# EAGLE design v3 (EAGLE 9.6.0)
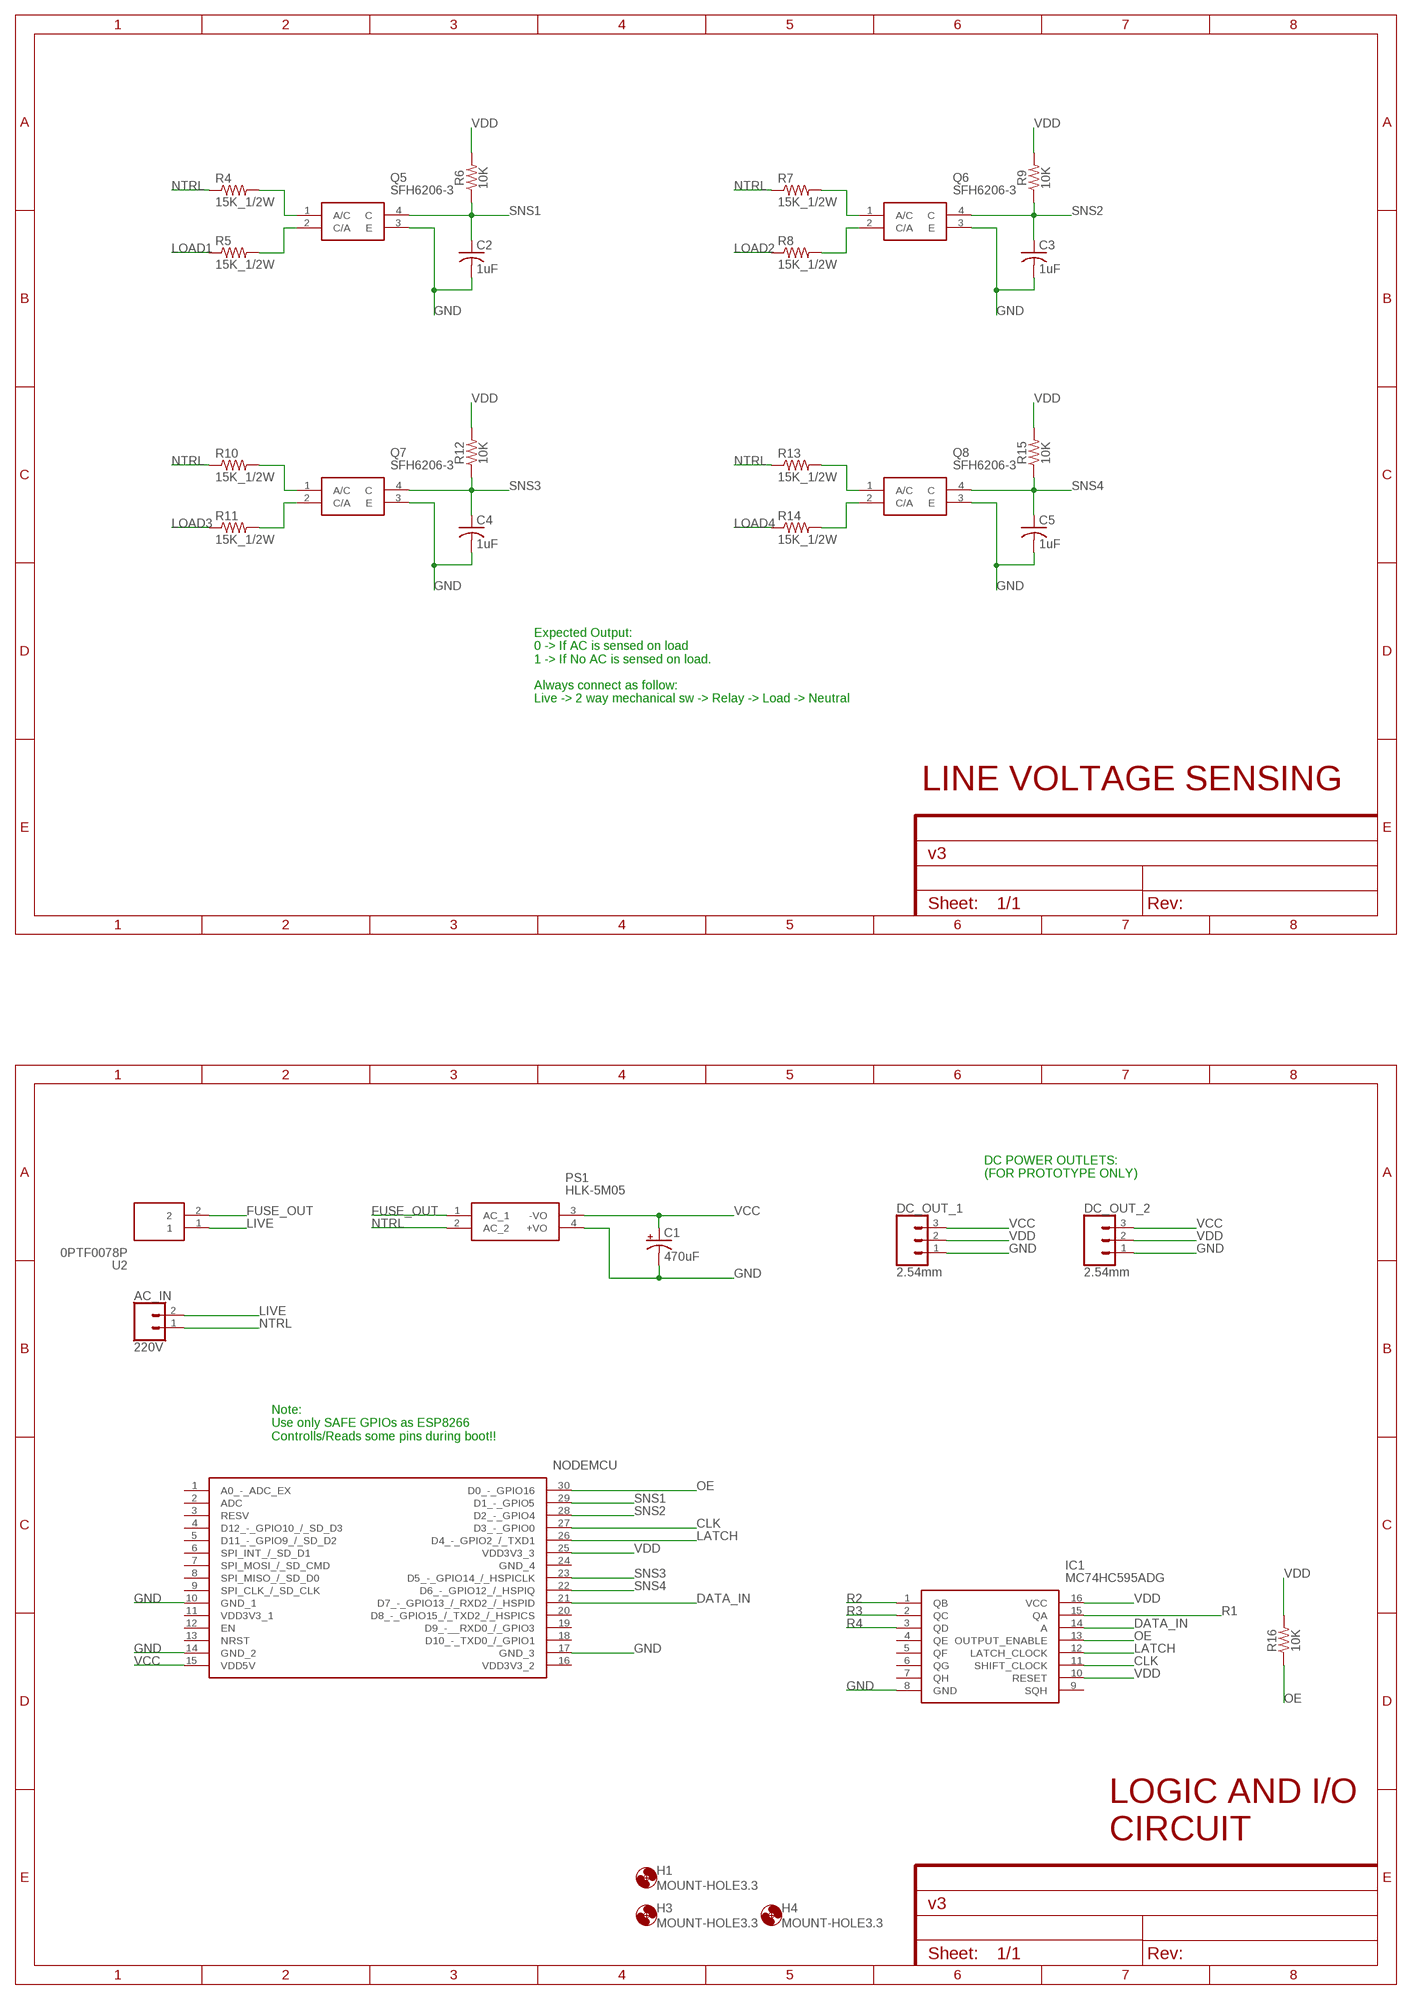
[diagram p0: schematic, sheet 1, part 1 of 2]
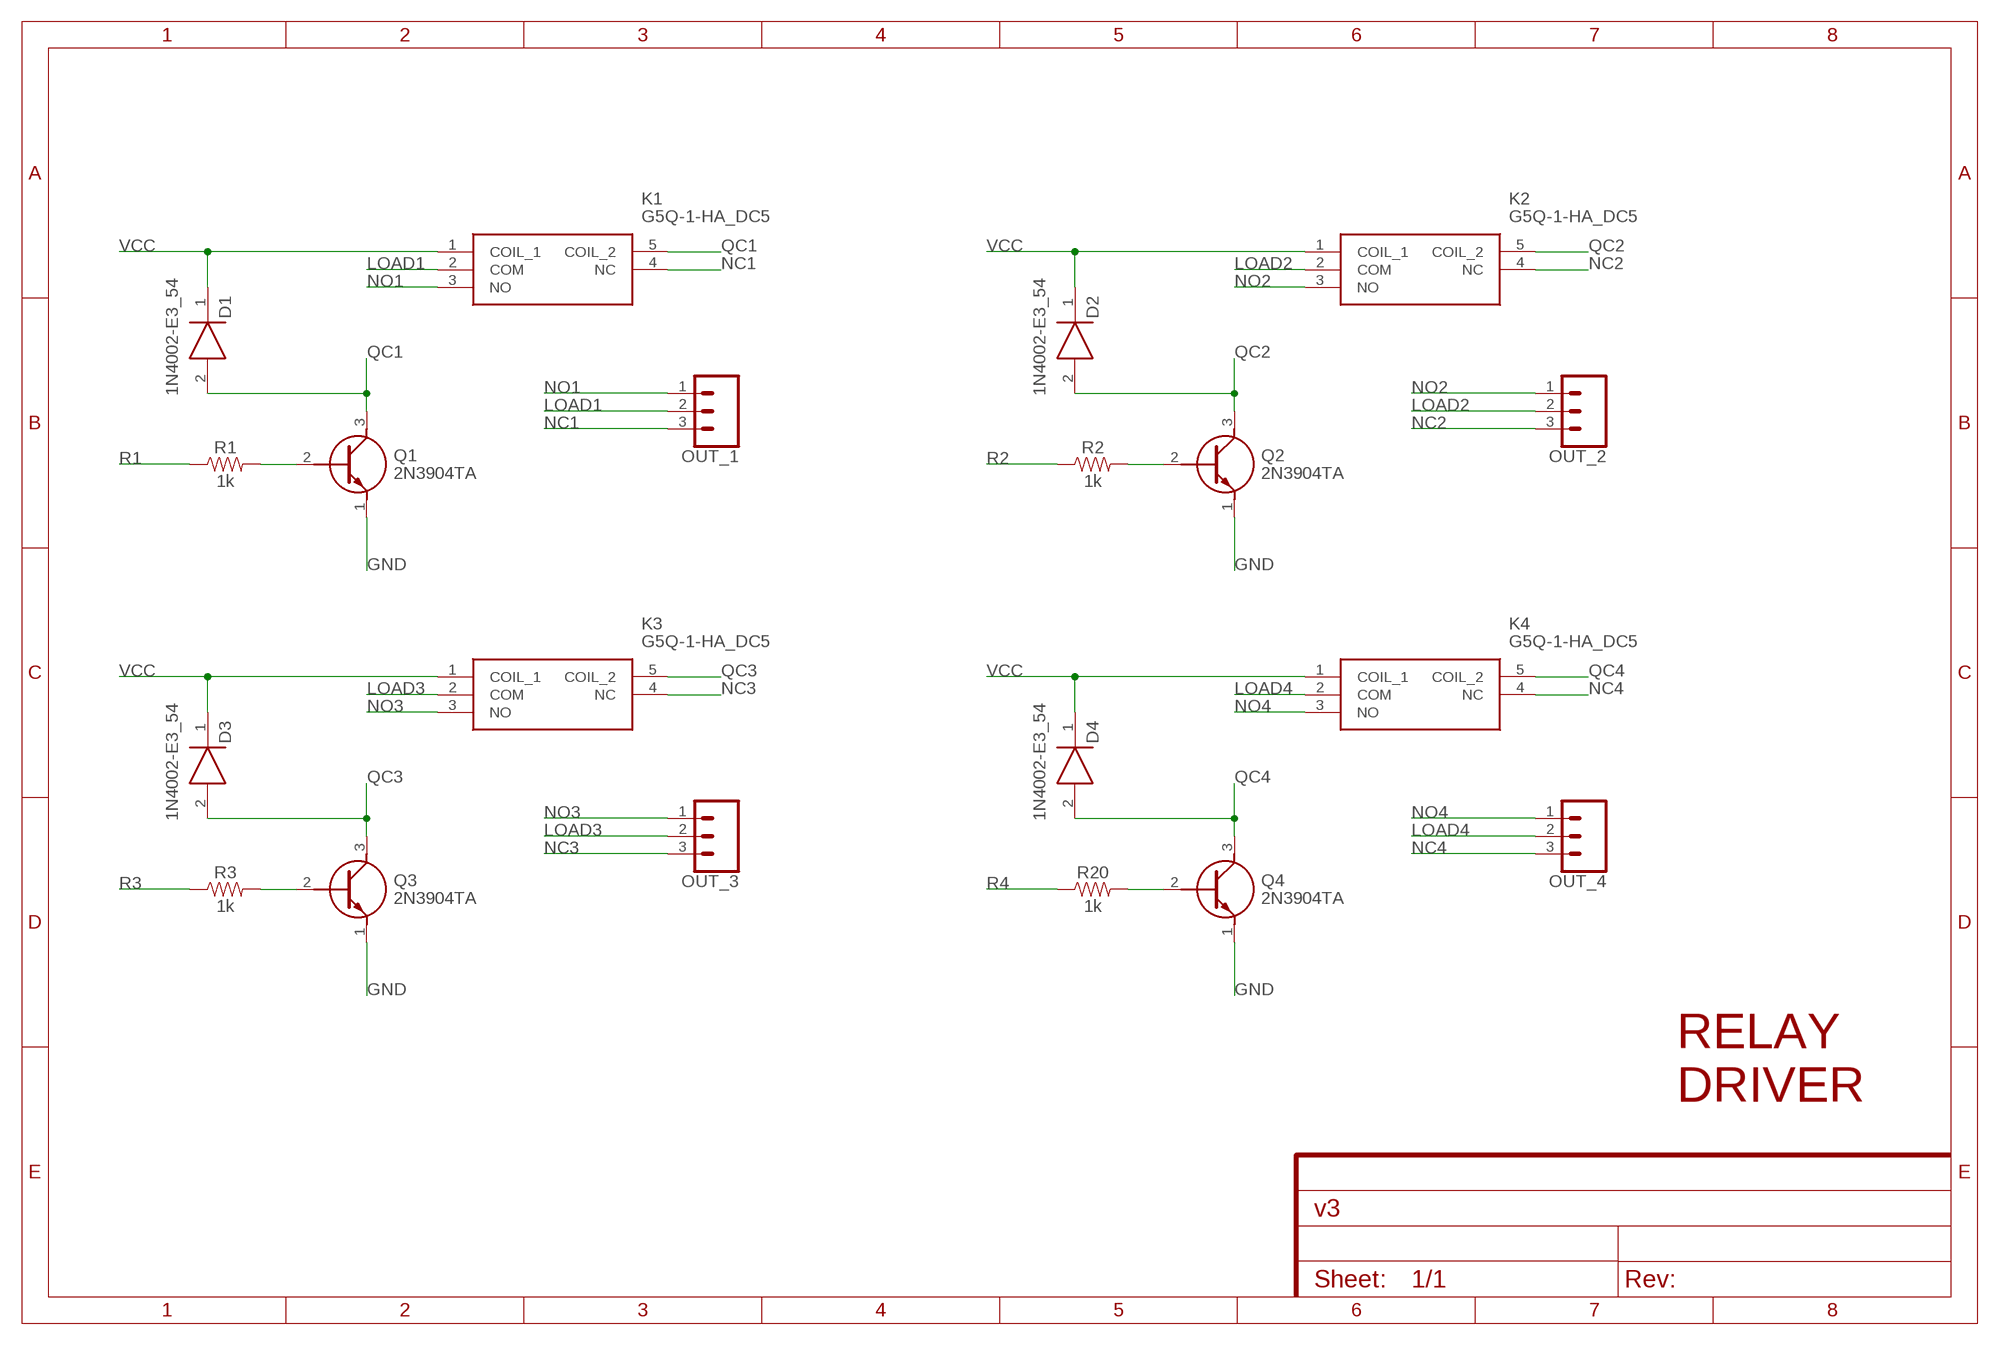
[diagram p1: schematic, sheet 1, part 2 of 2]

## Parts
AC_IN  220V  CONN_025MM  [SCREWTERMINAL-5MM-2]
C1  470uF  1000UF-RADIAL-5MM-35V-20%-KIT  [CPOL-RADIAL-5MM-10MM-KIT]
C2  1uF  C-USC0805  [C0805]
C3  1uF  C-USC0805  [C0805]
C4  1uF  C-USC0805  [C0805]
C5  1uF  C-USC0805  [C0805]
D1  1N4002-E3_54  [DIOAD1405W86L465D235]
D2  1N4002-E3_54  [DIOAD1405W86L465D235]
D3  1N4002-E3_54  [DIOAD1405W86L465D235]
D4  1N4002-E3_54  [DIOAD1405W86L465D235]
DC_OUT_1  2.54mm  CONN_03  [1X03]
DC_OUT_2  2.54mm  CONN_03  [1X03]
H1  MOUNT-HOLE3.3  [3,3]
H3  MOUNT-HOLE3.3  [3,3]
H4  MOUNT-HOLE3.3  [3,3]
IC1  MC74HC595ADG  [SOIC127P600X175-16N]
K1  G5Q-1-HA_DC5  [G5Q1EU12DC]
K2  G5Q-1-HA_DC5  [G5Q1EU12DC]
K3  G5Q-1-HA_DC5  [G5Q1EU12DC]
K4  G5Q-1-HA_DC5  [G5Q1EU12DC]
NODEMCU  113990105  [DIP2286W64P254L4826H735Q30N]
OUT_1  CONN_03-SCREW-5MM  [SCREWTERMINAL-5MM-3]
OUT_2  CONN_03-SCREW-5MM  [SCREWTERMINAL-5MM-3]
OUT_3  CONN_03-SCREW-5MM  [SCREWTERMINAL-5MM-3]
OUT_4  CONN_03-SCREW-5MM  [SCREWTERMINAL-5MM-3]
PS1  HLK-5M05  [HLK5M05]
Q1  2N3904TA  [BC33740TA]
Q2  2N3904TA  [BC33740TA]
Q3  2N3904TA  [BC33740TA]
Q4  2N3904TA  [BC33740TA]
Q5  SFH6206-3  [SOP254P1005X410-4N]
Q6  SFH6206-3  [SOP254P1005X410-4N]
Q7  SFH6206-3  [SOP254P1005X410-4N]
Q8  SFH6206-3  [SOP254P1005X410-4N]
R1  1k  1KOHM-0603-1/10W-1%  [0603]
R2  1k  1KOHM-0603-1/10W-1%  [0603]
R3  1k  1KOHM-0603-1/10W-1%  [0603]
R4  15K_1/2W  R-US_R1210  [R1210]
R5  15K_1/2W  R-US_R1210  [R1210]
R6  10K  1KOHM-0603-1/10W-1%  [0603]
R7  15K_1/2W  R-US_R1210  [R1210]
R8  15K_1/2W  R-US_R1210  [R1210]
R9  10K  1KOHM-0603-1/10W-1%  [0603]
R10  15K_1/2W  R-US_R1210  [R1210]
R11  15K_1/2W  R-US_R1210  [R1210]
R12  10K  1KOHM-0603-1/10W-1%  [0603]
R13  15K_1/2W  R-US_R1210  [R1210]
R14  15K_1/2W  R-US_R1210  [R1210]
R15  10K  1KOHM-0603-1/10W-1%  [0603]
R16  10K  1KOHM-0603-1/10W-1%  [0603]
R20  1k  1KOHM-0603-1/10W-1%  [0603]
U2  0PTF0078P  [0PTF0078P]

## Nets
CLK: IC1.11(SHIFT_CLOCK) NODEMCU.27(D3_-_GPIO0)
DATA_IN: IC1.14(A) NODEMCU.21(D7_-_GPIO13_/_RXD2_/_HSPID)
FUSE_OUT: PS1.1(AC_1) U2.2
GND: C1.- C2.2 C3.2 C4.2 C5.2 DC_OUT_1.1 DC_OUT_2.1 IC1.8(GND) NODEMCU.10(GND_1) NODEMCU.14(GND_2) NODEMCU.17(GND_3) PS1.4(+VO) Q1.1(E) Q2.1(E) Q3.1(E) Q4.1(E) Q5.3(E) Q6.3(E) Q7.3(E) Q8.3(E)
LATCH: IC1.12(LATCH_CLOCK) NODEMCU.26(D4_-_GPIO2_/_TXD1)
LIVE: AC_IN.2 U2.1
LOAD1: K1.2(COM) OUT_1.2 R5.1
LOAD2: K2.2(COM) OUT_2.2 R8.1
LOAD3: K3.2(COM) OUT_3.2 R11.1
LOAD4: K4.2(COM) OUT_4.2 R14.1
N$1: Q5.1(A/C) R4.2
N$2: Q5.2(C/A) R5.2
N$3: Q6.1(A/C) R7.2
N$4: Q1.2(B) R1.2
N$5: Q2.2(B) R2.2
N$6: Q6.2(C/A) R8.2
N$7: Q7.1(A/C) R10.2
N$8: Q7.2(C/A) R11.2
N$9: Q8.1(A/C) R13.2
N$10: Q8.2(C/A) R14.2
N$11: Q3.2(B) R3.2
N$12: Q4.2(B) R20.2
NC1: K1.4(NC) OUT_1.3
NC2: K2.4(NC) OUT_2.3
NC3: K3.4(NC) OUT_3.3
NC4: K4.4(NC) OUT_4.3
NO1: K1.3(NO) OUT_1.1
NO2: K2.3(NO) OUT_2.1
NO3: K3.3(NO) OUT_3.1
NO4: K4.3(NO) OUT_4.1
NTRL: AC_IN.1 PS1.2(AC_2) R4.1 R7.1 R10.1 R13.1
OE: IC1.13(OUTPUT_ENABLE) NODEMCU.30(D0_-_GPIO16) R16.1
QC1: D1.2(A) K1.5(COIL_2) Q1.3(C)
QC2: D2.2(A) K2.5(COIL_2) Q2.3(C)
QC3: D3.2(A) K3.5(COIL_2) Q3.3(C)
QC4: D4.2(A) K4.5(COIL_2) Q4.3(C)
R1: IC1.15(QA) R1.1
R2: IC1.1(QB) R2.1
R3: IC1.2(QC) R3.1
R4: IC1.3(QD) R20.1
SNS1: C2.1 NODEMCU.29(D1_-_GPIO5) Q5.4(C) R6.1
SNS2: C3.1 NODEMCU.28(D2_-_GPIO4) Q6.4(C) R9.1
SNS3: C4.1 NODEMCU.23(D5_-_GPIO14_/_HSPICLK) Q7.4(C) R12.1
SNS4: C5.1 NODEMCU.22(D6_-_GPIO12_/_HSPIQ) Q8.4(C) R15.1
VCC: C1.+ D1.1(K) D2.1(K) D3.1(K) D4.1(K) DC_OUT_1.3 DC_OUT_2.3 K1.1(COIL_1) K2.1(COIL_1) K3.1(COIL_1) K4.1(COIL_1) NODEMCU.15(VDD5V) PS1.3(-VO)
VDD: DC_OUT_1.2 DC_OUT_2.2 IC1.10(RESET) IC1.16(VCC) NODEMCU.25(VDD3V3_3) R6.2 R9.2 R12.2 R15.2 R16.2
Unconnected: IC1.4(QE) IC1.5(QF) IC1.6(QG) IC1.7(QH) IC1.9(SQH) NODEMCU.1(A0_-_ADC_EX) NODEMCU.2(ADC) NODEMCU.3(RESV) NODEMCU.4(D12_-_GPIO10_/_SD_D3) NODEMCU.5(D11_-_GPIO9_/_SD_D2) NODEMCU.6(SPI_INT_/_SD_D1) NODEMCU.7(SPI_MOSI_/_SD_CMD) NODEMCU.8(SPI_MISO_/_SD_D0) NODEMCU.9(SPI_CLK_/_SD_CLK) NODEMCU.12(EN) NODEMCU.13(NRST) NODEMCU.18(D10_-_TXD0_/_GPIO1) NODEMCU.19(D9_-__RXD0_/_GPIO3) NODEMCU.20(D8_-_GPIO15_/_TXD2_/_HSPICS)

## Notes on the sheet
- Expected Output:
  0 -> If AC is sensed on load
  1 -> If No AC is sensed on load.
  
  Always connect as follow:
  Live -> 2 way mechanical sw -> Relay -> Load -> Neutral
- LINE VOLTAGE SENSING
- DC POWER OUTLETS:
  (FOR PROTOTYPE ONLY)
- Note:
  Use only SAFE GPIOs as ESP8266
  Controlls/Reads some pins during boot!!
- RELAY
  DRIVER
- LOGIC AND I/O
  CIRCUIT

## Power pins joined to a net without a drawn wire
GND_4: NODEMCU.24(GND_4)
VDD3V3_1: NODEMCU.11(VDD3V3_1)
VDD3V3_2: NODEMCU.16(VDD3V3_2)

## Library data of the parts
AC_IN = SparkFun-Connectors:CONN_02: Multi connection point. Often used as Generic Header-pin footprint for 0.1 inch spaced/style header connections On any of the 0.1 inch spaced packages, you can populate with these: Break Away Headers - Straight <https://www.sparkfun.com/products/116> (PRT-00116) Break Away Male Headers - Right Angle <https://www.sparkfun.com/products/553> (PRT-00553) Female Headers <https://www.sparkfun.com/products/115> (PRT-00115) Break Away Headers - Machine Pin <https://www.sparkfun.com/products/117> (PRT-00117) Break Away Female Headers - Swiss Machine Pin <https://www.sparkfun.com/products/743> (PRT-00743) For SCREWTERMINALS and SPRING TERMINALS visit here: Screw Terimnals on SparkFun.com <https://www.sparkfun.com/search/results?term=Screw+Terminals> (5mm/3.5mm/2.54mm spacing) This device is also useful as a general connection point to wire up your design to another part of your project. Our various solder wires solder well into these plated through hole pads. Hook-Up Wire - Assortment (Stranded, 22 AWG) <https://www.sparkfun.com/products/11375> (PRT-11375) Hook-Up Wire - Assortment (Solid Core, 22 AWG) <https://www.sparkfun.com/products/11367> (PRT-11367) View the entire wire category on our website here <https://www.sparkfun.com/categories/141> Special notes: Molex polarized connector foot print use with: PRT-08233 with associated crimp pins and housings. 2.54_SCREWTERM for use with PRT-10571. 3.5mm Screw Terminal footprints for PRT-08084 5mm Screw Terminal footprints for use with PRT-08432; SF_SKU: PRT-08432
C1 = SparkFun-Capacitors:1000UF: 1,000µF/1mF ceramic capacitors A capacitor is a passive two-terminal electrical component used to store electrical energy temporarily in an electric field. CAP-08070; PROD_ID: CAP-09538; VALUE: 1mf
C2-C5 = rcl:C-US: CAPACITOR, American symbol; SPICEPREFIX: C
D1-D4 = SamacSys_Parts:1N4002-E3_54: VISHAY - 1N4002-E3/54 - STANDARD DIODE, 1A, 100V, DO-204AL, FULL REEL Source: Datasheet <https://componentsearchengine.com/Datasheets/2/1N4002-E3_54.pdf>; DESCRIPTION: VISHAY - 1N4002-E3/54 - STANDARD DIODE, 1A, 100V, DO-204AL, FULL REEL; HEIGHT: mm; MANUFACTURER_NAME: Vishay; MANUFACTURER_PART_NUMBER: 1N4002-E3/54; MOUSER_PART_NUMBER: 625-1N4002-E3/54; MOUSER_PRICE-STOCK: https://www.mouser.co.uk/ProductDetail/Vishay-Semiconductors/1N4002-E3-54?qs=N4vtoAxH%2FSqs13dJhGS5gw%3D%3D
DC_OUT_1 DC_OUT_2 = SparkFun-Connectors:CONN_03: Multi connection point. Often used as Generic Header-pin footprint for 0.1 inch spaced/style header connections On any of the 0.1 inch spaced packages, you can populate with these: Break Away Headers - Straight <https://www.sparkfun.com/products/116> (PRT-00116) Break Away Male Headers - Right Angle <https://www.sparkfun.com/products/553> (PRT-00553) Female Headers <https://www.sparkfun.com/products/115> (PRT-00115) Break Away Headers - Machine Pin <https://www.sparkfun.com/products/117> (PRT-00117) Break Away Female Headers - Swiss Machine Pin <https://www.sparkfun.com/products/743> (PRT-00743) Stackable Header - 3 Pin (Female, 0.1") <https://www.sparkfun.com/products/13875> (PRT-13875) For SCREWTERMINALS and SPRING TERMINALS visit here: Screw Terimnals on SparkFun.com <https://www.sparkfun.com/search/results?term=Screw+Terminals> (5mm/3.5mm/2.54mm spacing) This device is also useful as a general connection point to wire up your design to another part of your project. Our various solder wires solder well into these plated through hole pads. Hook-Up Wire - Assortment (Stranded, 22 AWG) <https://www.sparkfun.com/products/11375> (PRT-11375) Hook-Up Wire - Assortment (Solid Core, 22 AWG) <https://www.sparkfun.com/products/11367> (PRT-11367) View the entire wire category on our website here <https://www.sparkfun.com/categories/141> Special notes: Molex polarized connector foot print use with SKU : PRT-08232 with associated crimp pins and housings.; PROD_ID: XXX-00000; VALUE: 455-1750-1-ND
H1 H3 H4 = holes:MOUNT-HOLE: MOUNTING HOLE with drill center marker
IC1 = SamacSys_Parts:MC74HC595ADG: Shift Register 8-Bit Latch 3State SOIC16 ON Semiconductor MC74HC595ADG, 8-stage, Shift Register, Serial to Serial/Parallel, 2 6 V, 16-Pin SOIC Source: Datasheet <http://www.onsemi.com/pub/Collateral/MC74HC595A-D.PDF>; DESCRIPTION: Shift Register 8-Bit Latch 3State SOIC16 ON Semiconductor MC74HC595ADG, 8-stage, Shift Register, Serial to Serial/Parallel, 2 6 V, 16-Pin SOIC; HEIGHT: 1.75mm; MANUFACTURER_NAME: ON Semiconductor; MANUFACTURER_PART_NUMBER: MC74HC595ADG; MOUSER_PART_NUMBER: 863-MC74HC595ADG; MOUSER_PRICE-STOCK: https://www.mouser.co.uk/ProductDetail/ON-Semiconductor/MC74HC595ADG?qs=qg33o%252B8vzFqEn75WJUGD8w%3D%3D
K1-K4 = SamacSys_Parts:G5Q-1-HA_DC5: General Purpose Relays PCB Power Relay Mini 1-pole 10A Source: Datasheet <https://omronfs.omron.com/en_US/ecb/products/pdf/en-g5q.pdf>; DESCRIPTION: General Purpose Relays PCB Power Relay Mini 1-pole 10A; HEIGHT: 15.8mm; MANUFACTURER_NAME: Omron Electronics; MANUFACTURER_PART_NUMBER: G5Q-1-HA DC5; MOUSER_PART_NUMBER: 653-G5Q-1-HADC5; MOUSER_PRICE-STOCK: https://www.mouser.co.uk/ProductDetail/Omron-Electronics/G5Q-1-HA-DC5?qs=xZ%2FP%252Ba9zWqZWP6NLX9Nrlg%3D%3D
NODEMCU = SamacSys_Parts:113990105: NodeMCU DEVKIT V1.0 Source: Datasheet <https://github.com/nodemcu/nodemcu-devkit-v1.0/blob/master/NODEMCU_DEVKIT_V1.0.PDF>; ARROW_PART_NUMBER: 113990105; ARROW_PRICE-STOCK: https://www.arrow.com/en/products/113990105/seeed-technology-limited; DESCRIPTION: NodeMCU DEVKIT V1.0; HEIGHT: 7.35mm; MANUFACTURER_NAME: Seeed Studio; MANUFACTURER_PART_NUMBER: 113990105; MOUSER_PART_NUMBER: 713-113990105; MOUSER_PRICE-STOCK: https://www.mouser.co.uk/ProductDetail/Seeed-Studio/113990105?qs=SElPoaY2y5KMx8k1roAIKw%3D%3D
OUT_1-OUT_4 = SparkFun-Connectors:CONN_03: Multi connection point. Often used as Generic Header-pin footprint for 0.1 inch spaced/style header connections On any of the 0.1 inch spaced packages, you can populate with these: Break Away Headers - Straight <https://www.sparkfun.com/products/116> (PRT-00116) Break Away Male Headers - Right Angle <https://www.sparkfun.com/products/553> (PRT-00553) Female Headers <https://www.sparkfun.com/products/115> (PRT-00115) Break Away Headers - Machine Pin <https://www.sparkfun.com/products/117> (PRT-00117) Break Away Female Headers - Swiss Machine Pin <https://www.sparkfun.com/products/743> (PRT-00743) Stackable Header - 3 Pin (Female, 0.1") <https://www.sparkfun.com/products/13875> (PRT-13875) For SCREWTERMINALS and SPRING TERMINALS visit here: Screw Terimnals on SparkFun.com <https://www.sparkfun.com/search/results?term=Screw+Terminals> (5mm/3.5mm/2.54mm spacing) This device is also useful as a general connection point to wire up your design to another part of your project. Our various solder wires solder well into these plated through hole pads. Hook-Up Wire - Assortment (Stranded, 22 AWG) <https://www.sparkfun.com/products/11375> (PRT-11375) Hook-Up Wire - Assortment (Solid Core, 22 AWG) <https://www.sparkfun.com/products/11367> (PRT-11367) View the entire wire category on our website here <https://www.sparkfun.com/categories/141> Special notes: Molex polarized connector foot print use with SKU : PRT-08232 with associated crimp pins and housings.; PROD_ID: CONN-10134; SF_SKU: PRT-08433
PS1 = SamacSys_Parts:HLK-5M05: 5W ultra-compact power module HLK-5M05 Source: Datasheet <http://www.hlktech.net/product_detail.php?ProId=60>; ARROW_PART_NUMBER: HLK-5M05; DESCRIPTION: 5W ultra-compact power module HLK-5M05; HEIGHT: 18mm; MANUFACTURER_NAME: Hi-Link; MANUFACTURER_PART_NUMBER: HLK-5M05
Q1-Q4 = SamacSys_Parts:2N3904TA: Transistor GP BJT NPN 40V 0.2A TO92-3 Source: Datasheet <http://www.onsemi.com/pub/Collateral/2N3904-D.pdf>; DESCRIPTION: Transistor GP BJT NPN 40V 0.2A TO92-3; HEIGHT: mm; MANUFACTURER_NAME: ON Semiconductor; MANUFACTURER_PART_NUMBER: 2N3904TA; MOUSER_PART_NUMBER: 512-2N3904TA; MOUSER_PRICE-STOCK: https://www.mouser.co.uk/ProductDetail/ON-Semiconductor-Fairchild/2N3904TA?qs=ljbEvF4DwOOn1Ev%2FzRYaoA%3D%3D
Q5-Q8 = SamacSys_Parts:SFH6206-3: SMD-4 CPLR 100-320% CTR -e3 Source: Datasheet <https://componentsearchengine.com/Datasheets/1/SFH6206-3.pdf>; DESCRIPTION: SMD-4 CPLR 100-320% CTR -e3; HEIGHT: 4.1mm; MANUFACTURER_NAME: Vishay; MANUFACTURER_PART_NUMBER: SFH6206-3; MOUSER_PART_NUMBER: 782-SFH6206-3; MOUSER_PRICE-STOCK: https://www.mouser.com/Search/Refine.aspx?Keyword=782-SFH6206-3
R1-R3 R20 = SparkFun-Resistors:1KOHM: 1kΩ resistor A resistor is a passive two-terminal electrical component that implements electrical resistance as a circuit element. Resistors act to reduce current flow, and, at the same time, act to lower voltage levels within circuits. - Wikipedia; PROD_ID: RES-07856
R4 R5 R7 R8 R10 R11 R13 R14 = rcl:R-US_: RESISTOR, American symbol; SPICEPREFIX: R
R6 R9 R12 R15 R16 = SparkFun-Resistors:1KOHM: 1kΩ resistor A resistor is a passive two-terminal electrical component that implements electrical resistance as a circuit element. Resistors act to reduce current flow, and, at the same time, act to lower voltage levels within circuits. - Wikipedia; PROD_ID: RES-07856; VALUE: 1k
U2 = SamacSys_Parts:0PTF0078P: FUSEHOLDER-OPEN 5X20MM UL94V0 PITCH 22/6 Source: Datasheet <https://media.digikey.com/pdf/Data Sheets/Littelfuse PDFs/PTF075_77_78.pdf>; DESCRIPTION: FUSEHOLDER-OPEN 5X20MM UL94V0 PITCH 22/6; HEIGHT: 11.5mm; MANUFACTURER_NAME: LITTELFUSE; MANUFACTURER_PART_NUMBER: 0PTF0078P; MOUSER_PART_NUMBER: 576-0PTF0078P; MOUSER_PRICE-STOCK: https://www.mouser.co.uk/ProductDetail/Littelfuse/0PTF0078P?qs=Co4VkB5J4%2Fsczy6gG8s%2FsA%3D%3D

## Board
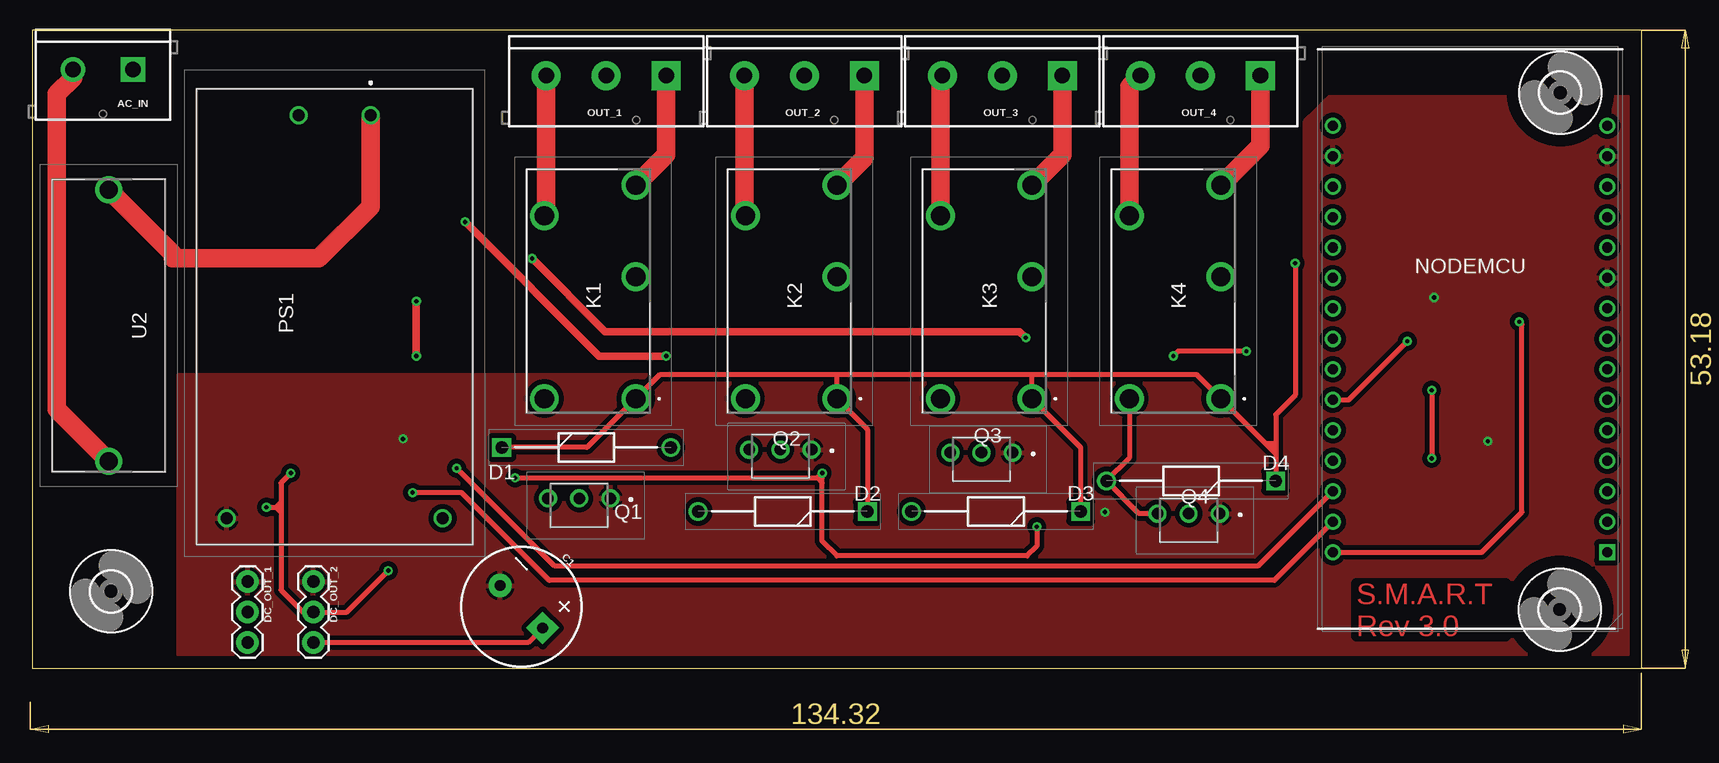
[diagram p2: board, top side]
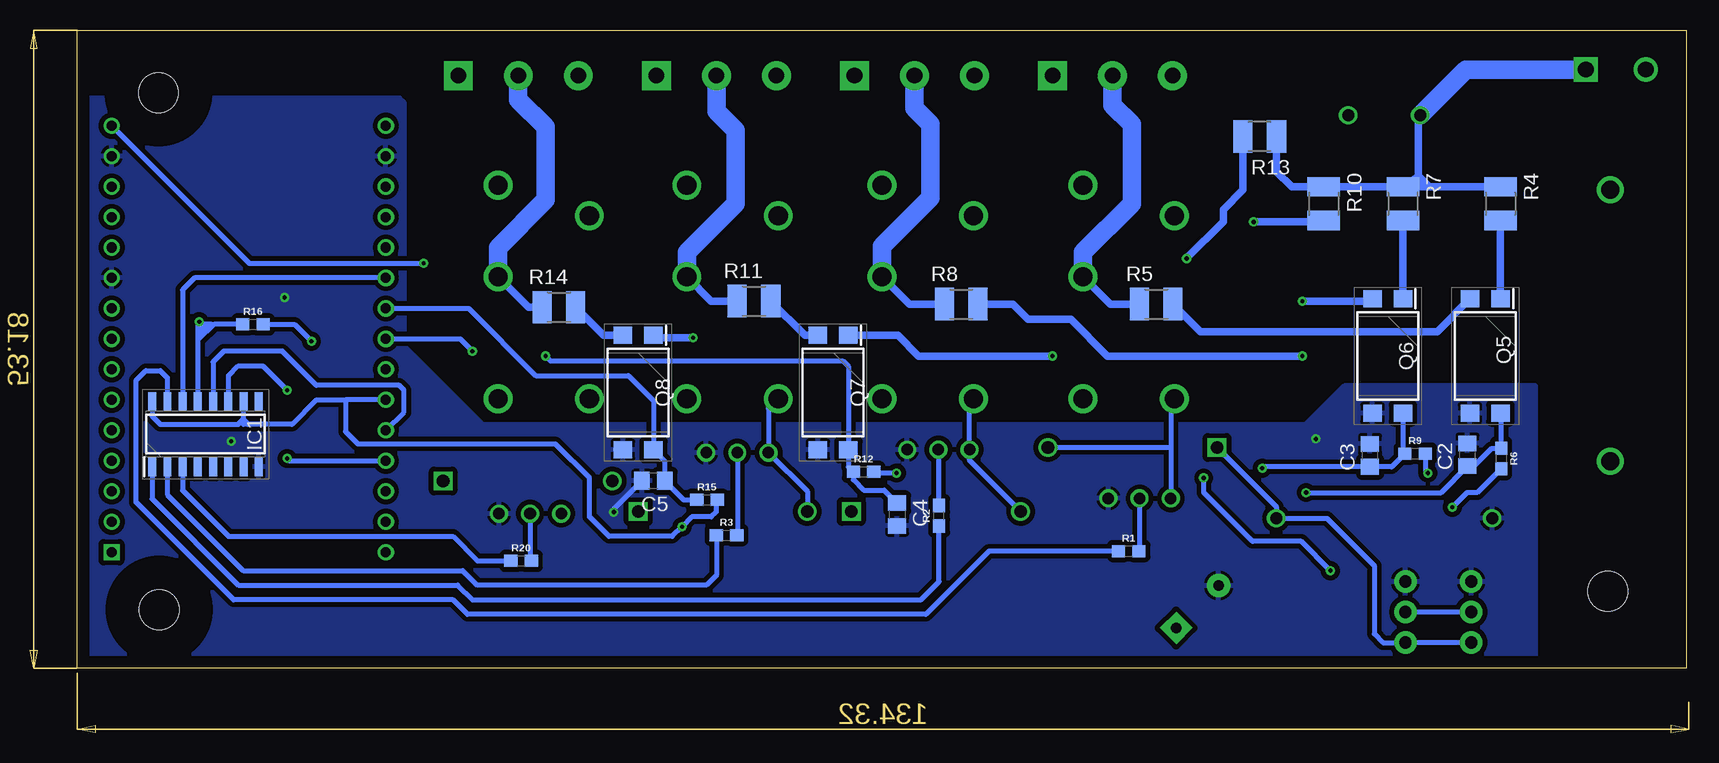
[diagram p3: board, bottom side, seen from below]

Size 134.14 x 53.18 mm. Coordinates in mm from the lower left corner, seen from the top.
Outline: 0,0 134.14,0 134.14,53.18 0,53.18 0,0
Copper layers (1*16): Top 0.035mm / dielectric 1.5mm / Bottom 0.035mm
Design rules "default": minimum track width 6mil, minimum drill 0.35mm, track to track 6mil, track to pad 6mil, pad to pad 6mil, via to via 6mil, smd to smd 6mil, copper to edge 40mil, drill to drill 6mil, minimum pad ring 10mil, minimum via ring 8mil, stop-mask expansion 4mil, vias tented up to drill 0mil, thermal gap 10mil

### Footprints (pad centres in the part's own frame; a part is rotated, then mirrored left to right if it is on the bottom)
SCREWTERMINAL-5MM-2 = drill 1.3 pad 2.032 square: 1 0,0 | drill 1.3 pad 2.032: 2 5,0
CPOL-RADIAL-5MM-10MM-KIT = drill 0.9 pad 1.93 square: + 2.5,0 | drill 0.9 pad 1.93: - -2.5,0
C0805 = smd 1.3 x 1.5: 1 -0.95,0; 2 0.95,0
DIOAD1405W86L465D235 = drill 1.05 pad 1.575 square: 1 0,0 | drill 1.05 pad 1.575: 2 14.1,0
1X03 = drill 1.016 pad 1.88: 1 0,0; 2 2.54,0; 3 5.08,0
3,3 = hole 3.3: 0,0
SOIC127P600X175-16N = smd 1.55 x 0.65: 1 -2.725,4.445; 2 -2.725,3.175; 3 -2.725,1.905; 4 -2.725,0.635; 5 -2.725,-0.635; 6 -2.725,-1.905; 7 -2.725,-3.175; 8 -2.725,-4.445; 9 2.725,-4.445; 10 2.725,-3.175; 11 2.725,-1.905; 12 2.725,-0.635; 13 2.725,0.635; 14 2.725,1.905; 15 2.725,3.175; 16 2.725,4.445
G5Q1EU12DC = drill 1.6 pad 2.4: 1 0,0; 2 10.16,0; 3 17.78,0; 4 15.24,7.62; 5 0,7.62
DIP2286W64P254L4826H735Q30N = drill 0.835 pad 1.235 square: 1 -11.43,17.78 | drill 0.835 pad 1.235: 2 -11.43,15.24; 3 -11.43,12.7; 4 -11.43,10.16; 5 -11.43,7.62; 6 -11.43,5.08; 7 -11.43,2.54; 8 -11.43,0; 9 -11.43,-2.54; 10 -11.43,-5.08; 11 -11.43,-7.62; 12 -11.43,-10.16; 13 -11.43,-12.7; 14 -11.43,-15.24; 15 -11.43,-17.78; 16 11.43,-17.78; 17 11.43,-15.24; 18 11.43,-12.7; 19 11.43,-10.16; 20 11.43,-7.62; 21 11.43,-5.08; 22 11.43,-2.54; 23 11.43,0; 24 11.43,2.54; 25 11.43,5.08; 26 11.43,7.62; 27 11.43,10.16; 28 11.43,12.7; 29 11.43,15.24; 30 11.43,17.78
SCREWTERMINAL-5MM-3 = drill 1.3 pad 2.413 square: 1 0,0 | drill 1.3 pad 2.413: 2 5,0; 3 10,0
HLK5M05 = drill 1 pad 1.5: 1 0,0; 2 0,-6; 3 33.6,6; 4 33.6,-12
BC33740TA = drill 0.96 pad 1.493: 1 -1.7,-0.585; 2 0.9,-0.585; 3 3.5,-0.585
SOP254P1005X410-4N = smd 1.4 x 1.55: 1 -4.775,1.27; 2 -4.775,-1.27; 3 4.775,-1.27; 4 4.775,1.27
0603 = smd 1.1 x 1: 1 -0.85,0; 2 0.85,0
R1210 = smd 1.6 x 2.7: 1 -1.4,0; 2 1.4,0
0PTF0078P = drill 1.5 pad 2.25: 1 -11.3,0; 2 11.3,0

### Placement (x,y rotation side)
AC_IN  8.38,49.89 180 top
C1  40.76,5.12 315 top
C2  18.24,17.78 90 bottom
C3  26.37,17.73 90 bottom
C4  65.79,12.8 270 bottom
C5  86.11,15.6 180 bottom
D1  39.12,18.39 0 top
D2  69.6,13.06 180 top
D3  87.38,13.06 180 top
D4  103.63,15.6 180 top
DC_OUT_1  17.93,7.21 270 top
DC_OUT_2  23.42,7.21 270 top
H1  6.55,6.4 0 top
H3  127.3,4.88 0 top
H4  127.36,47.96 0 top
IC1  123.44,19.51 90 bottom
K1  50.29,22.45 90 top
K2  67.06,22.45 90 top
K3  83.31,22.45 90 top
K4  99.06,22.45 90 top
NODEMCU  119.84,27.43 180 top
OUT_1  52.83,49.38 180 top
OUT_2  69.34,49.38 180 top
OUT_3  85.85,49.38 180 top
OUT_4  102.36,49.38 180 top
PS1  28.19,46.08 270 top
Q1  46.48,13.56 180 top
Q2  63.25,17.63 180 top
Q3  80.01,17.37 180 top
Q4  97.28,12.29 180 top
Q5  16.76,26.01 270 bottom
Q6  24.89,26.01 270 bottom
Q7  71.12,22.96 270 bottom
Q8  87.38,22.96 270 bottom
R1  46.48,9.75 0 bottom
R2  62.28,12.7 90 bottom
R3  80.01,11.07 0 bottom
R4  15.49,38.71 270 bottom
R5  44.2,30.33 0 bottom
R6  15.44,17.48 270 bottom
R7  23.62,38.71 270 bottom
R8  60.45,30.33 0 bottom
R9  22.61,17.88 0 bottom
R10  30.23,38.71 270 bottom
R11  77.72,30.58 0 bottom
R12  68.58,16.36 0 bottom
R13  35.56,44.3 180 bottom
R14  93.98,30.07 0 bottom
R15  81.64,14.02 0 bottom
R16  119.48,28.65 0 bottom
R20  97.13,8.94 0 bottom
U2  6.35,28.55 90 top

### Tracks (layer width: path | path; a pad name or v marks a point on that pad's centre or on a via)
CLK  (via drill 0.35)
  Top 0.406: v116.64,23.16 v116.64,17.48
  Bottom 0.406: IC1.11 121.51,22.26 121.51,24.38 120.7,25.2 118.67,25.2 v116.64,23.16 | v116.64,17.48 116.43,17.27 NODEMCU.27
DATA_IN
  Bottom 0.406: NODEMCU.21 124.36,32.51 125.35,31.52 IC1.14
FUSE_OUT
  Top 1.524: U2.2 11.68,34.52 11.68,34.14 23.88,34.14 28.19,38.46 PS1.1
GND  (via drill 0.35)
  Bottom 0.406: C5.2 89.41,13.24 v89.41,13.01
  other vias: 30.89,19.1 121.31,18.9 116.84,30.89
  pour Bottom (isolate 0.406): 12.6,23.57 12.6,0 134.11,0 134.11,47.14 133.71,47.55 107.29,47.55 106.88,47.14 106.88,46.33 106.88,26.82 101.19,21.13 100.38,20.32 31.7,20.32 28.45,23.57
  pour Top (isolate 0.406): 12.19,23.57 12.19,0 134.11,0 134.11,47.55 131.67,47.55 108.1,47.55 106.88,46.33 106.07,45.52 106.07,27.23 103.23,24.38 52.02,24.38 12.19,24.38
LATCH
  Bottom 0.406: NODEMCU.26 106.88,21.34 106.88,23.16 107.29,23.57 114.2,23.57 117.04,26.42 121.92,26.42 122.81,25.53 IC1.12
LIVE
  Top 1.524: AC_IN.2 3.38,49.2 2.03,47.85 2.03,21.57 U2.1
LOAD1
  Bottom 0.61: R5.1 48.01,30.33 K1.2
  Bottom 1.524: OUT_1.2 47.83,46.92 46.23,45.31 46.23,38.71 50.29,34.65 K1.2
LOAD2
  Bottom 0.61: K2.2 64.77,30.33 R8.1
  Bottom 1.524: OUT_2.2 64.34,46.66 62.99,45.31 62.99,39.22 67.06,35.15 K2.2
LOAD3
  Bottom 0.61: K3.2 81.28,30.58 R11.1
  Bottom 1.524: OUT_3.2 80.85,46.41 79.25,44.81 79.25,38.71 83.31,34.65 K3.2
LOAD4
  Bottom 0.61: K4.2 96.52,30.07 R14.1
  Bottom 1.524: OUT_4.2 97.36,47.38 95.1,45.11 95.1,39.01 99.06,35.05 K4.2
N$1
  Bottom 0.61: R4.2 Q5.1
N$2
  Bottom 0.61: Q5.2 20.78,28.04 40.51,28.04 R5.2
N$3
  Bottom 0.61: R7.2 Q6.1
N$4
  Bottom 0.406: Q1.2 45.58,9.8 R1.2
N$5
  Bottom 0.406: Q2.2 62.35,13.62 R2.2
N$6  (via drill 0.35)
  Top 0.61: v32,30.58 v32,26.01
  Bottom 0.61: Q6.2 26.36,30.58 v32,30.58 | v32,26.01 48.26,26.01 51.31,29.06 54.86,29.06 56.13,30.33 R8.2
N$7  (via drill 0.35)
  Top 0.61: v52.83,26.01 47.24,26.01 v36.07,37.19
  Bottom 0.61: Q7.1 65.73,27.74 64.01,26.01 v52.83,26.01 | v36.07,37.19 30.35,37.19 R10.2
N$8
  Bottom 0.61: R11.2 73.48,27.74 Q7.2
N$9  (via drill 0.35)
  Top 0.61: v82.8,27.53 82.3,28.04 47.75,28.04 v41.66,34.14
  Bottom 0.61: Q8.1 85.9,27.53 v82.8,27.53 | v41.66,34.14 38.61,37.19 38.61,38.2 36.96,39.85 R13.2
N$10
  Bottom 0.61: R14.2 90.24,27.74 Q8.2
N$11
  Bottom 0.406: Q3.2 79.11,11.12 R3.2
N$12
  Bottom 0.406: Q4.2 96.38,9.04 R20.2
N$13
  Bottom 0.406: 122.94,28.65 123.95,28.65 123.75,28.45 123.75,28.04 | 123.75,27.84 123.75,28.04 | 123.75,28.04 123.34,28.45
NC1
  Top 1.524: OUT_1.3 42.83,37.85
  Top 1.905: 42.83,37.85 K1.4
NC2
  Top 1.524: OUT_2.3 59.34,37.79 K2.4
NC3
  Top 1.524: OUT_3.3 75.69,49.22 K3.4
NC4
  Top 1.524: OUT_4.3 91.44,48.46 K4.4
NO1
  Top 1.524: OUT_1.1 52.83,42.77 K1.3
NO2
  Top 1.524: OUT_2.1 69.34,42.52 K2.3
NO3
  Top 1.524: OUT_3.1 85.85,42.77 K3.3
NO4
  Top 1.524: OUT_4.1 102.36,43.54 K4.3
NTRL
  Bottom 0.61: R4.1 22.35,40.11 | 22.35,40.11 R7.1 R10.1 32.9,40.11 34.16,41.37 R13.1 | PS1.2 22.35,45.92 22.35,41.05 | 22.35,41.05 22.35,40.11 | 21.54,40.23 22.35,41.05 | 22.35,41.05 22.76,40.64
  Bottom 1.524: AC_IN.1 18.38,49.89 PS1.2
OE  (via drill 0.35)
  Top 0.406: NODEMCU.30 120.8,9.65 124.16,13.01 124.16,28.65 v123.95,28.85
  Bottom 0.406: 124.16,22.31 IC1.13 124.08,27.3 | R16.1 122.73,28.65 124.08,27.3 | v123.95,28.85 124.08,28.73 124.08,27.3
QC1
  Bottom 0.406: K1.5 42.98,22.14 42.98,18.39 | 42.98,18.39 Q1.3 | D1.2 42.98,18.39
QC2
  Bottom 0.406: D2.2 59.75,17.31 Q2.3 59.75,22.14 K2.5
QC3
  Bottom 0.406: K3.5 76.51,21.64 Q3.3 73.28,14.72 D3.2
QC4
  Top 0.406: K4.5 91.44,17.5 D4.2 92.25,12.88 Q4.3
R1
  Bottom 0.406: R1.1 58.12,9.75 63.4,4.47 101.6,4.47 102.82,5.69 121.11,5.69 129.24,13.82 129.24,23.98 128.42,24.79 127.2,24.79 126.62,24.21 IC1.15
R2
  Bottom 0.406: IC1.1 127.89,14.1 120.7,6.91 102.41,6.91 101.19,5.69 63.8,5.69 62.28,7.21 R2.1
R3
  Bottom 0.406: IC1.2 126.62,14.45 120.29,8.13 102.01,8.13 100.79,6.91 81.69,6.91 80.86,7.74 R3.1
R4
  Bottom 0.406: R20.1 100.79,8.94 102.82,10.97 121.51,10.97 125.35,14.81 IC1.3
SNS1  (via drill 0.35)
  Top 0.406: NODEMCU.29 103.53,7.32 43.08,7.32 35.76,14.63 v31.7,14.63
  Bottom 0.406: v31.7,14.63 20.44,14.63 C2.1 17.71,16.83 16.26,18.29 15.48,18.29 R6.1 | 15.49,18.38 R6.1 | R6.1 15.44,21.18 Q5.4
SNS2  (via drill 0.35)
  Top 0.406: v35.36,16.66 43.48,8.53 102.21,8.53 NODEMCU.28
  Bottom 0.406: Q6.4 23.62,18.05 R9.1 24.56,16.78 C3.1 35.24,16.78 v35.36,16.66
SNS3  (via drill 0.35)
  Top 0.406: v95.1,26.01 95.5,26.42 v101.19,26.42
  Bottom 0.406: C4.1 66.87,14.83 68.58,14.83 69.43,15.68 R12.1 69.85,16.78 Q7.4 69.85,25.15 70.31,25.6 94.69,25.6 v95.1,26.01 | NODEMCU.23 102.21,27.43 v101.19,26.42
SNS4
  Bottom 0.406: R15.1 83.58,14.02 C5.1 85.16,17.24 Q8.4 86.11,22.3 88.19,24.38 95.91,24.38 101.5,29.97 NODEMCU.22
VCC  (via drill 0.35)
  Top 0.406: D1.1 46.23,18.39 K1.1 52.32,24.49 67.06,24.49 | D2.1 69.6,19.91 K2.1 67.06,24.49 | 102.82,18.69 K4.1 97.03,24.49 83.31,24.49 | 102.82,18.69 103.23,18.29 | 103.23,18.29 103.63,17.88 | 103.63,17.88 D4.1 | 67.06,24.49 83.31,24.49 | 83.31,24.49 K3.1 87.38,18.39 D3.1 | v105.26,33.73 105.26,22.76 103.63,21.13 103.63,18.69 | 103.63,18.69 103.63,17.88 | 103.23,18.29 103.63,18.69 | 103.63,18.69 102.82,18.69 | C1.+ 41.31,2.13 DC_OUT_2.3
  Bottom 0.406: D1.1 34.19,13.47 PS1.3 29.95,12.48 26.01,8.53 26.01,2.85 25.3,2.13 DC_OUT_2.3 DC_OUT_1.3 | NODEMCU.15 119.79,33.73 v105.26,33.73
VDD  (via drill 0.35)
  Top 0.406: 20.73,13.82 20.73,15.44 v21.54,16.26 | 20.73,13.82 20.73,13.41 | 20.73,13.41 20.73,13.01 | 20.73,13.01 20.73,6.5 22.55,4.67 DC_OUT_2.2 26.21,4.67 v29.67,8.13 | v19.51,13.41 20.32,13.41 | 20.32,13.41 20.73,13.41 | 20.32,13.41 20.73,13.82 | 20.32,13.41 20.73,13.01 | v40.23,15.85 65.43,15.85 | 65.43,15.85 v65.84,16.26 65.84,15.85 | v83.72,11.79 83.72,10.16 82.91,9.35 67.06,9.35 65.84,10.57 65.84,15.44 | 65.84,15.44 65.84,15.85 | 65.43,15.85 65.84,15.85 | 65.43,15.85 65.84,15.44 | NODEMCU.25 109.73,22.35 v114.61,27.23
  Bottom 0.406: DC_OUT_1.2 DC_OUT_2.2 | IC1.16 127.89,21.01 127.2,20.32 120.7,20.32 120.29,20.73 | IC1.10 120.27,20.75 120.29,20.73 | NODEMCU.25 111.76,22.35 | 111.76,22.35 114.2,22.35 116.23,20.32 119.89,20.32 | 119.89,20.32 120.29,20.32 | 120.29,20.73 119.89,20.32 | R9.2 21.76,16.47 v21.54,16.26 | R6.2 17.44,14.63 18.29,14.63 v19.51,13.41 | v29.67,8.13 32.11,10.57 36.17,10.57 40.23,14.63 v40.23,15.85 | v65.84,16.26 67.63,16.26 R12.2 | R15.2 80.87,13.93 80.87,13.01 81.28,12.6 82.91,12.6 v83.72,11.79 84.53,10.97 89.81,10.97 91.44,12.6 91.44,15.85 94.28,18.69 110.74,18.69 111.76,19.71 111.76,22.35 | v114.61,27.23 116.03,28.65 R16.2

### Text on the board
Top: S.M.A.R.T / Rev 3.0